# EAGLE design q2 (EAGLE 9.6.2)
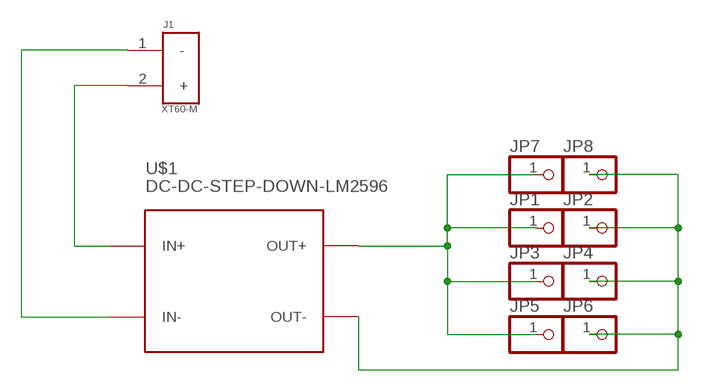
[diagram p0: schematic, sheet 1]

## Parts
J1  XT60-M  [AMASS_XT60-M]
JP1  PINHD-1X1  [1X01]
JP2  PINHD-1X1  [1X01]
JP3  PINHD-1X1  [1X01]
JP4  PINHD-1X1  [1X01]
JP5  PINHD-1X1  [1X01]
JP6  PINHD-1X1  [1X01]
JP7  PINHD-1X1  [1X01]
JP8  PINHD-1X1  [1X01]
U$1  DC-DC-STEP-DOWN-LM2596  [DC-DC-STEP-DOWN-LM2596]

## Nets
N$1: J1.2(+) U$1.IN+
N$2: J1.1(-) U$1.IN-
N$3: JP1.1 JP3.1 JP5.1 JP7.1 U$1.OUT+
N$4: JP2.1 JP4.1 JP6.1 JP8.1 U$1.OUT-

## Library data of the parts
J1 = XT60-M:XT60-M: DC supply; XT60; male; PIN:2; for cable; soldered; 60A; 500V; AVAILABILITY: Unavailable; DESCRIPTION: Plug; DC supply; XT60; male; PIN: 2; for cable; soldered; 30A; 500V; MF: AMASS; MP: XT60-M; PACKAGE: Package; PRICE: None
JP1-JP8 = adafruit:PINHD-1X1: Pin header 1x1 for 0.1" spacing With round pins
U$1 = diy-modules:DC-DC-STEP-DOWN-LM2596: DC/DC Step-Down Regulator based on LM2596-ADJ chip LM2596 datasheet available here: http://www.ti.com/lit/ds/symlink/lm2596.pdf Click here to find device on ebay.com <http://www.ebay.com/sch/lm2596+power+regulator>

## Net classes
0 default: width 0.305 mm, drill 0.508 mm, clearance 0.254 mm

## Board
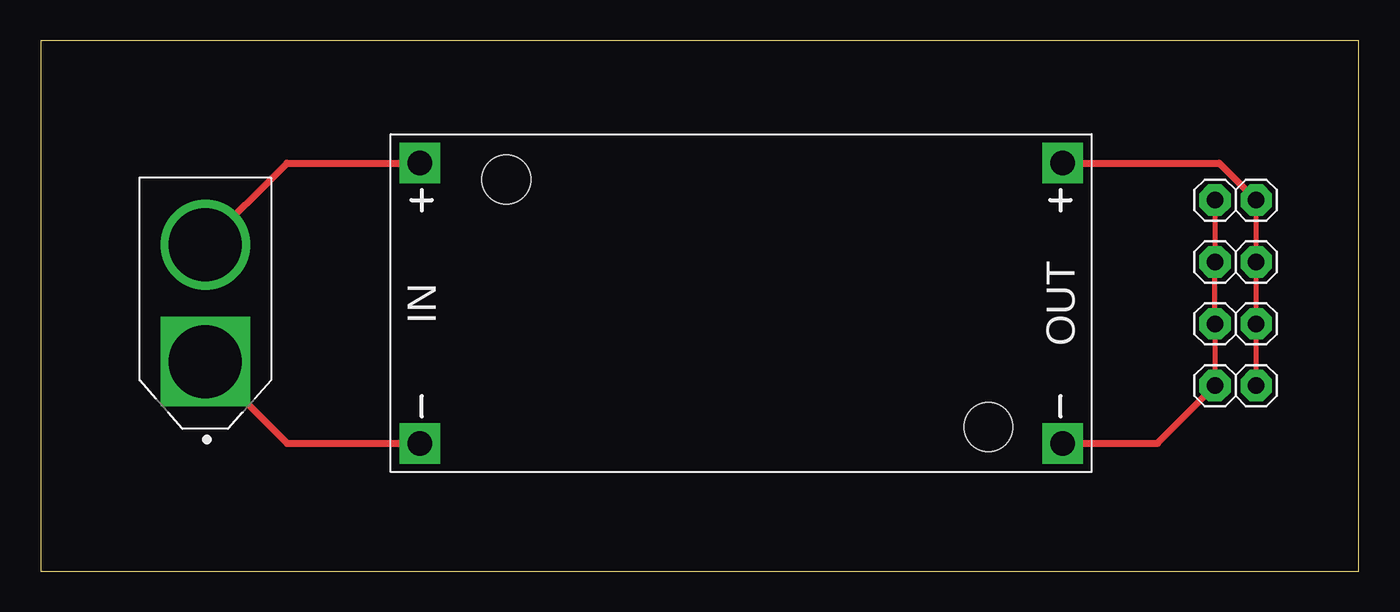
[diagram p1: board, top side]

Size 81.26 x 32.69 mm. Coordinates in mm from the lower left corner, seen from the top.
Outline: 0,0 81.26,0 81.26,32.69 0,32.69 0,0
Copper layers (1*16): Top 0.035mm / dielectric 1.5mm / Bottom 0.035mm
Design rules "default": minimum track width 6mil, minimum drill 0.35mm, track to track 6mil, track to pad 6mil, pad to pad 6mil, via to via 6mil, smd to smd 6mil, copper to edge 40mil, drill to drill 6mil, minimum pad ring 10mil, minimum via ring 8mil, stop-mask expansion 4mil, vias tented up to drill 0mil, thermal gap 10mil

### Footprints (pad centres in the part's own frame; a part is rotated, then mirrored left to right if it is on the bottom)
AMASS_XT60-M = drill 4.5 square: 1 -3.6,0 | drill 4.5: 2 3.6,0
1X01 = drill 1.016 pad 1.93 octagon: 1 0,0
DC-DC-STEP-DOWN-LM2596 = drill 1.5 pad 2.5 square: IN+ -19.812,8.636; IN- -19.812,-8.636; OUT+ 19.812,8.636; OUT- 19.812,-8.636 | hole 3: -14.478,7.62; 15.24,-7.62

### Placement (x,y rotation side)
J1  10.16,16.51 90 top
JP1  74.93,11.43 90 top
JP2  72.39,11.43 0 top
JP3  74.93,15.24 0 top
JP4  72.39,15.24 0 top
JP5  74.93,19.05 0 top
JP6  72.39,19.05 0 top
JP7  74.93,22.86 0 top
JP8  72.39,22.86 0 top
U$1  43.18,16.51 0 top

### Tracks (layer width: path | path; a pad name or v marks a point on that pad's centre or on a via)
N$1
  Top 0.427: J1.2 15.2,25.15 U$1.IN+
N$2
  Top 0.427: J1.1 15.2,7.87 U$1.IN-
N$3
  Top 0.305: JP1.1 JP3.1 JP5.1 JP7.1
  Top 0.427: U$1.OUT+ 72.64,25.15 JP7.1
N$4
  Top 0.305: JP8.1 JP6.1 JP4.1 JP2.1
  Top 0.427: U$1.OUT- 68.83,7.87 JP2.1